# Altium schematic sheet Main.SchDoc
size A3; SheetNumber: 1; SheetTotal: 2
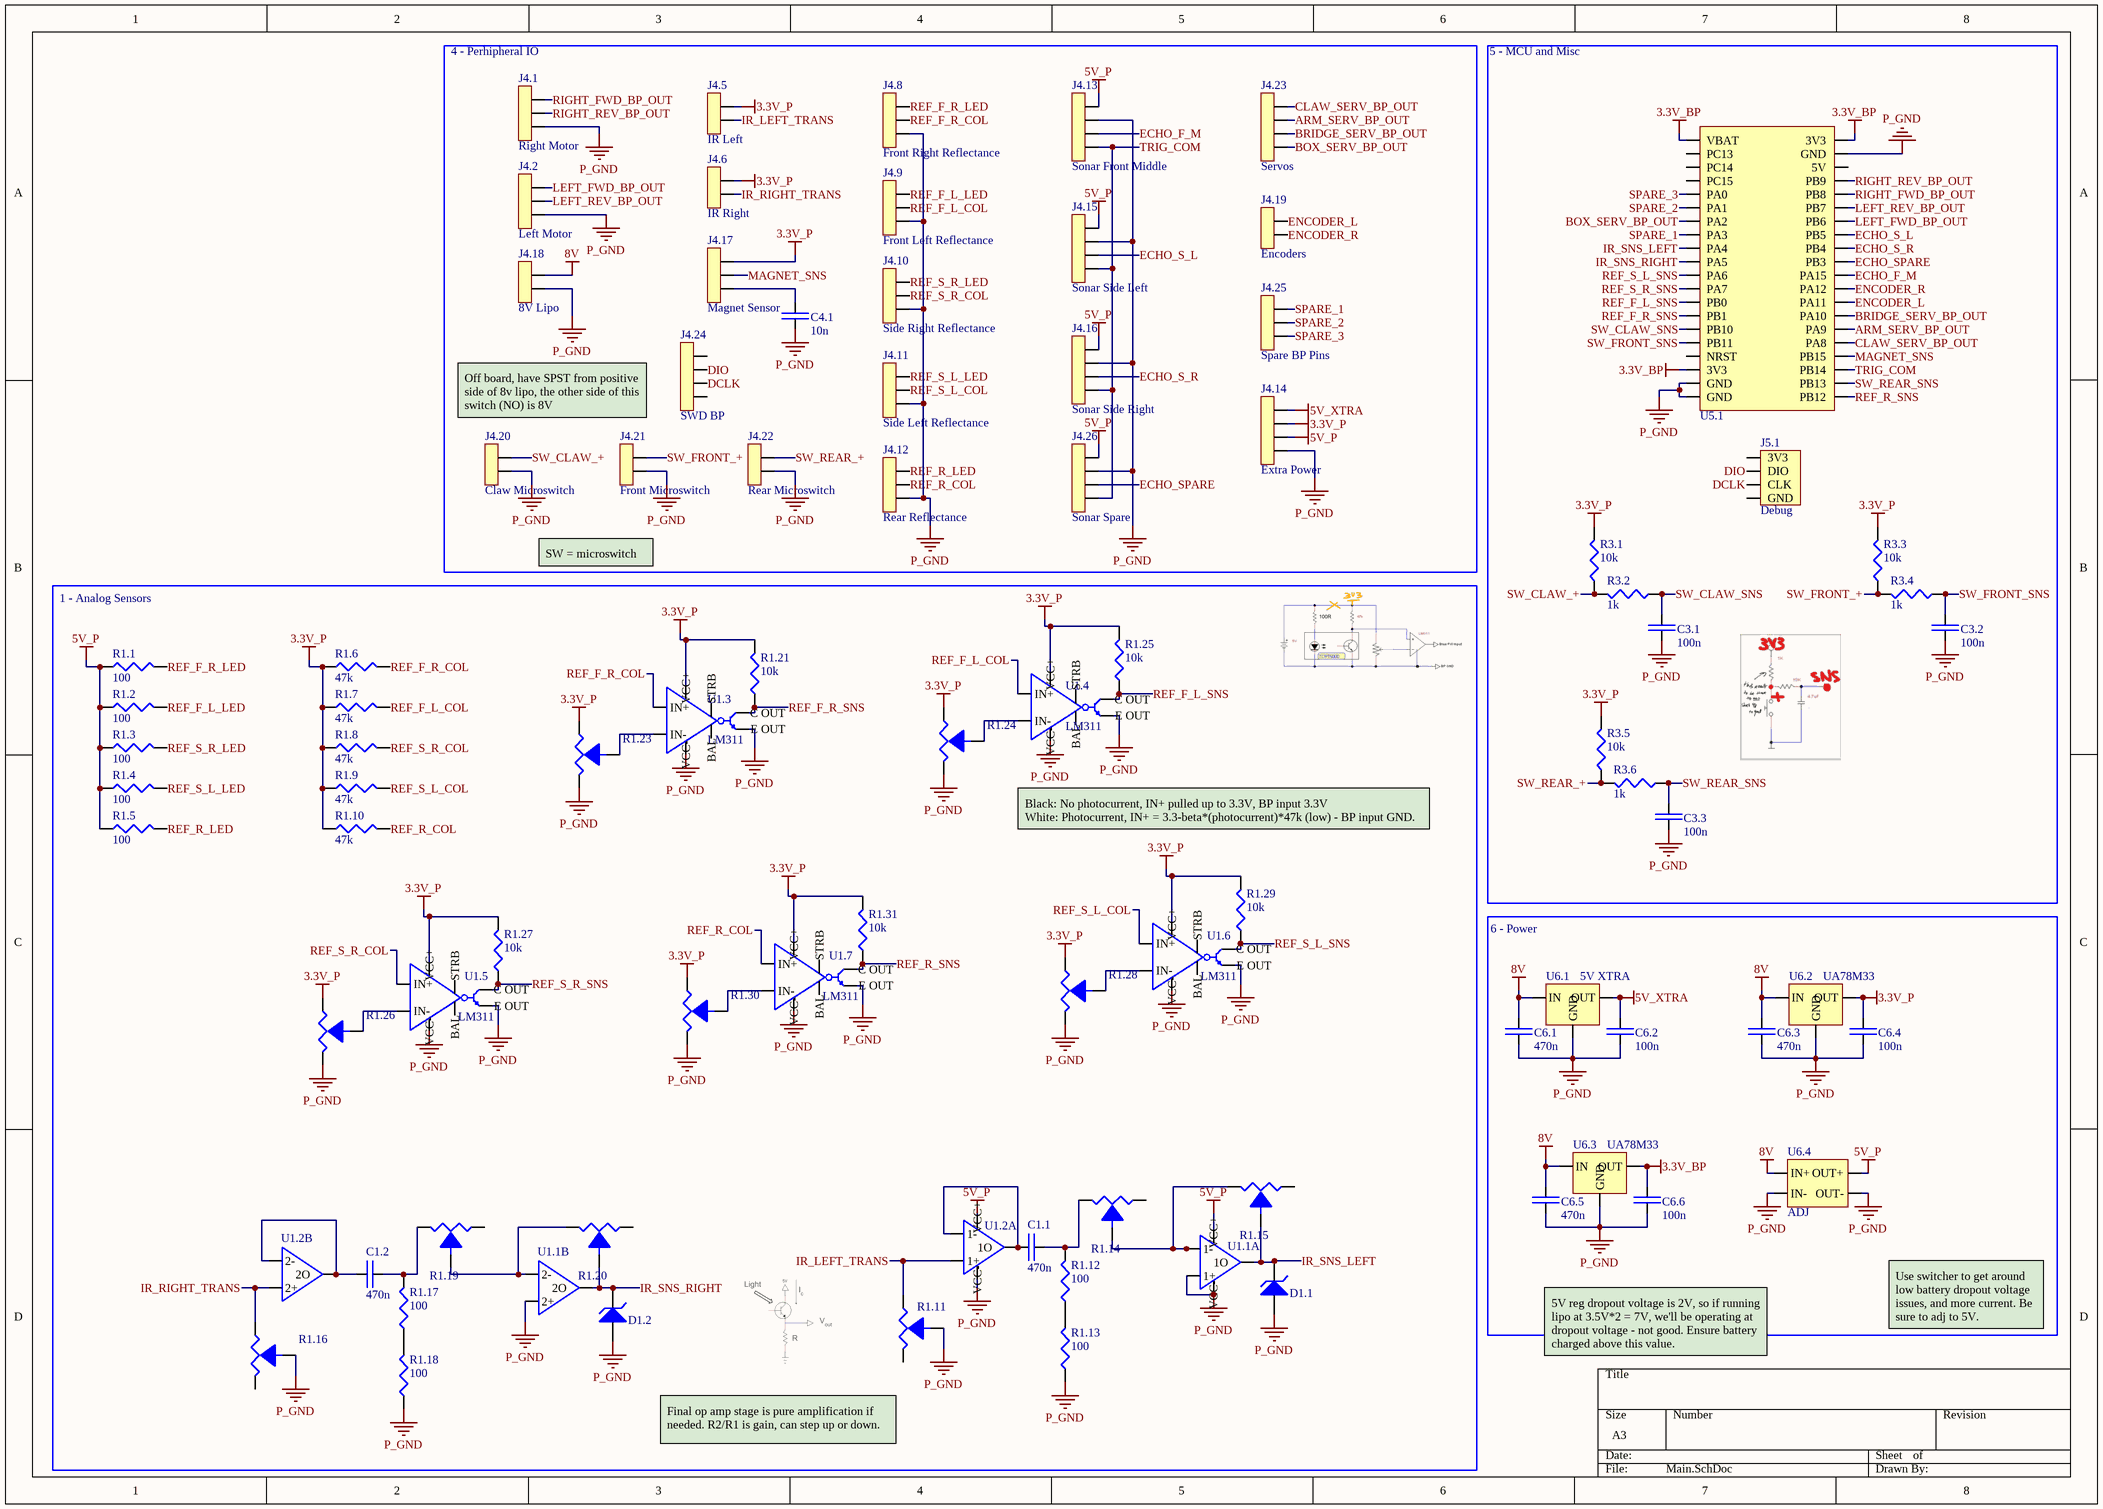
[diagram p0: Main.SchDoc]

## Parts
C1.1  470n  [Non Polarized Cap]
C1.2  470n  [Non Polarized Cap]
C3.1  100n  [Non Polarized Cap]
C3.2  100n  [Non Polarized Cap]
C3.3  100n  [Non Polarized Cap]
C4.1  10n  [Non Polarized Cap]
C6.1  470n  [Non Polarized Cap]
C6.2  100n  [Non Polarized Cap]
C6.3  470n  [Non Polarized Cap]
C6.4  100n  [Non Polarized Cap]
C6.5  470n  [Non Polarized Cap]
C6.6  100n  [Non Polarized Cap]
D1.1  3.3V  [Zener Generic]  (value not drawn)
D1.2  3.3V  [Zener Generic]  (value not drawn)
J4.1  Right Motor  [3pos JST]
J4.2  Left Motor  [3pos JST]
J4.5  IR Left  [2pos JST]
J4.6  IR Right  [2pos JST]
J4.8  Front Right Reflectance  [3pos JST]
J4.9  Front Left Reflectance  [3pos JST]
J4.10  Side Right Reflectance  [3pos JST]
J4.11  Side Left Reflectance  [3pos JST]
J4.12  Rear Reflectance  [3pos JST]
J4.13  Sonar Front Middle  [4Pos JST]
J4.14  Extra Power  [4Pos JST]
J4.15  Sonar Side Left  [4Pos JST]
J4.16  Sonar Side Right  [4Pos JST]
J4.17  Magnet Sensor  [3pos JST]
J4.18  8V Lipo  [2pos JST]
J4.19  Encoders  [2pos JST]
J4.20  Claw Microswitch  [2pos JST]
J4.21  Front Microswitch  [2pos JST]
J4.22  Rear Microswitch  [2pos JST]
J4.23  Servos  [4Pos JST]
J4.24  SWD BP  [4Pos JST]
J4.25  Spare BP Pins  [3pos JST]
J4.26  Sonar Spare  [4Pos JST]
J5.1  Debug  [Four Pads]
R1.1  100  [Res_Generic]
R1.2  100  [Res_Generic]
R1.3  100  [Res_Generic]
R1.4  100  [Res_Generic]
R1.5  100  [Res_Generic]
R1.6  47k  [Res_Generic]
R1.7  47k  [Res_Generic]
R1.8  47k  [Res_Generic]
R1.9  47k  [Res_Generic]
R1.10  47k  [Res_Generic]
R1.11  100k  [Pot Generic]  (value not drawn)
R1.12  100  [Res_Generic]
R1.13  100  [Res_Generic]
R1.14  10k  [Pot Generic]  (value not drawn)
R1.15  100k  [Pot Generic]  (value not drawn)
R1.16  100k  [Pot Generic]  (value not drawn)
R1.17  100  [Res_Generic]
R1.18  100  [Res_Generic]
R1.19  10k  [Pot Generic]  (value not drawn)
R1.20  100k  [Pot Generic]  (value not drawn)
R1.21  10k  [Res_Generic]
R1.23  10k  [Pot Generic]  (value not drawn)
R1.24  10k  [Pot Generic]  (value not drawn)
R1.25  10k  [Res_Generic]
R1.26  10k  [Pot Generic]  (value not drawn)
R1.27  10k  [Res_Generic]
R1.28  10k  [Pot Generic]  (value not drawn)
R1.29  10k  [Res_Generic]
R1.30  10k  [Pot Generic]  (value not drawn)
R1.31  10k  [Res_Generic]
R3.1  10k  [Res_Generic]
R3.2  1k  [Res_Generic]
R3.3  10k  [Res_Generic]
R3.4  1k  [Res_Generic]
R3.5  10k  [Res_Generic]
R3.6  1k  [Res_Generic]
U1.1  TL082IP  [DIP8]  (value not drawn)  (parts A,B of 2)
U1.2  TL082IP  [DIP8]  (value not drawn)  (parts A,B of 2)
U1.3  LM311  [DIP8]
U1.4  LM311  [DIP8]
U1.5  LM311  [DIP8]
U1.6  LM311  [DIP8]
U1.7  LM311  [DIP8]
U5.1  Bluepill  [DIP40]  (value not drawn)
U6.1  5V XTRA  [TO220]
U6.2  UA78M33  [TO220]
U6.3  UA78M33  [TO220]
U6.4  ADJ  [ADJ Switcher]

## Blocks framed on the sheet
4 - Perhipheral IO: C4.1 J4.1 J4.2 J4.5 J4.6 J4.8-J4.26
5 - MCU and Misc: C3.1-C3.3 J5.1 R3.1-R3.6 U5.1
1 - Analog Sensors: C1.1 C1.2 D1.1 D1.2 R1.1-R1.21 R1.23-R1.31 U1.1-U1.7
6 - Power: C6.1-C6.6 U6.1-U6.4

## Nets
3.3V_BP: C6.6.2 U5.1.1(VBAT) U5.1.18(3V3) U5.1.40(3V3) U6.3.3(OUT)
3.3V_P: C6.4.2 J4.5.2 J4.6.2 J4.14.3 J4.17.3 R1.6.1 R1.7.1 R1.8.1 R1.9.1 R1.10.1 R1.21.2 R1.23.3 R1.24.3 R1.25.2 R1.26.3 R1.27.2 R1.28.3 R1.29.2 R1.30.3 R1.31.2 R3.1.2 R3.3.2 R3.5.2 U1.3.8(VCC+) U1.4.8(VCC+) U1.5.8(VCC+) U1.6.8(VCC+) U1.7.8(VCC+) U6.2.3(OUT)
5V_P: J4.13.4 J4.14.2 J4.15.4 J4.16.4 J4.26.4 R1.1.1 R1.2.1 R1.3.1 R1.4.1 R1.5.1 U1.1.8(VCC+) U1.2.8(VCC+) U6.4.4(OUT+)
5V_XTRA: C6.2.2 J4.14.4 U6.1.3(OUT)
8V: C6.1.2 C6.3.2 C6.5.2 J4.18.2 U6.1.1(IN) U6.2.1(IN) U6.3.1(IN) U6.4.1(IN+)
P_GND: C3.1.1 C3.2.1 C3.3.1 C4.1.1 C6.1.1 C6.2.1 C6.3.1 C6.4.1 C6.5.1 C6.6.1 D1.1.1(Anode) D1.2.1(Anode) J4.1.1 J4.2.1 J4.8.1 J4.9.1 J4.10.1 J4.11.1 J4.12.1 J4.13.3 J4.14.1 J4.15.3 J4.16.3 J4.18.1 J4.20.1 J4.21.1 J4.22.1 J4.26.3 R1.11.2 R1.13.1 R1.16.2 R1.18.1 R1.23.1 R1.24.1 R1.26.1 R1.28.1 R1.30.1 U1.1.3(1+) U1.1.4(VCC-) U1.1.5(2+) U1.2.4(VCC-) U1.3.1(E_OUT) U1.3.4(VCC-) U1.4.1(E_OUT) U1.4.4(VCC-) U1.5.1(E_OUT) U1.5.4(VCC-) U1.6.1(E_OUT) U1.6.4(VCC-) U1.7.1(E_OUT) U1.7.4(VCC-) U5.1.19(GND) U5.1.20(GND) U5.1.39(GND) U6.1.2(GND) U6.2.2(GND) U6.3.2(GND) U6.4.2(IN-) U6.4.3(OUT-)
ARM_SERV_BP_OUT: J4.23.3 U5.1.26(PA9)
BOX_SERV_BP_OUT: J4.23.1 U5.1.7(PA2)
BRIDGE_SERV_BP_OUT: J4.23.2 U5.1.27(PA10)
CLAW_SERV_BP_OUT: J4.23.4 U5.1.25(PA8)
DCLK: J4.24.2 J5.1.3(CLK)
DIO: J4.24.3 J5.1.2(DIO)
ECHO_F_M: J4.13.2 U5.1.30(PA15)
ECHO_S_L: J4.15.2 U5.1.33(PB5)
ECHO_S_R: J4.16.2 U5.1.32(PB4)
ECHO_SPARE: J4.26.2 U5.1.31(PB3)
ENCODER_L: J4.19.2 U5.1.28(PA11)
ENCODER_R: J4.19.1 U5.1.29(PA12)
IR_LEFT_TRANS: J4.5.1 R1.11.3 U1.2.3(1+)
IR_RIGHT_TRANS: J4.6.1 R1.16.3 U1.2.5(2+)
IR_SNS_LEFT: D1.1.2(Cathode) R1.15.2 U1.1.1(1O) U5.1.9(PA4)
IR_SNS_RIGHT: D1.2.2(Cathode) R1.20.2 U1.1.7(2O) U5.1.10(PA5)
LEFT_FWD_BP_OUT: J4.2.3 U5.1.34(PB6)
LEFT_REV_BP_OUT: J4.2.2 U5.1.35(PB7)
MAGNET_SNS: J4.17.2 U5.1.24(PB15)
REF_F_L_COL: J4.9.2 R1.7.2 U1.4.2(IN+)
REF_F_L_LED: J4.9.3 R1.2.2
REF_F_L_SNS: R1.25.1 U1.4.7(C_OUT) U5.1.13(PB0)
REF_F_R_COL: J4.8.2 R1.6.2 U1.3.2(IN+)
REF_F_R_LED: J4.8.3 R1.1.2
REF_F_R_SNS: R1.21.1 U1.3.7(C_OUT) U5.1.14(PB1)
REF_R_COL: J4.12.2 R1.10.2 U1.7.2(IN+)
REF_R_LED: J4.12.3 R1.5.2
REF_R_SNS: R1.31.1 U1.7.7(C_OUT) U5.1.21(PB12)
REF_S_L_COL: J4.11.2 R1.9.2 U1.6.2(IN+)
REF_S_L_LED: J4.11.3 R1.4.2
REF_S_L_SNS: R1.29.1 U1.6.7(C_OUT) U5.1.11(PA6)
REF_S_R_COL: J4.10.2 R1.8.2 U1.5.2(IN+)
REF_S_R_LED: J4.10.3 R1.3.2
REF_S_R_SNS: R1.27.1 U1.5.7(C_OUT) U5.1.12(PA7)
RIGHT_FWD_BP_OUT: J4.1.3 U5.1.36(PB8)
RIGHT_REV_BP_OUT: J4.1.2 U5.1.37(PB9)
SPARE_1: J4.25.3 U5.1.8(PA3)
SPARE_2: J4.25.2 U5.1.6(PA1)
SPARE_3: J4.25.1 U5.1.5(PA0)
SW_CLAW_+: J4.20.2 R3.1.1 R3.2.2
SW_CLAW_SNS: C3.1.2 R3.2.1 U5.1.15(PB10)
SW_FRONT_+: J4.21.2 R3.3.1 R3.4.2
SW_FRONT_SNS: C3.2.2 R3.4.1 U5.1.16(PB11)
SW_REAR_+: J4.22.2 R3.5.1 R3.6.2
SW_REAR_SNS: C3.3.2 R3.6.1 U5.1.22(PB13)
TRIG_COM: J4.13.1 J4.15.1 J4.16.1 J4.26.1 U5.1.23(PB14)
NetC1.1_1: C1.1.1 U1.2.1(1O) U1.2.2(1-)
NetC1.1_2: C1.1.2 R1.12.2 R1.14.1
NetC1.2_1: C1.2.1 U1.2.6(2-) U1.2.7(2O)
NetC1.2_2: C1.2.2 R1.17.2 R1.19.1
NetC4.1_2: C4.1.2 J4.17.1
NetR1.12_1: R1.12.1 R1.13.2
NetR1.14_2: R1.14.2 R1.15.1 U1.1.2(1-)
NetR1.17_1: R1.17.1 R1.18.2
NetR1.19_2: R1.19.2 R1.20.1 U1.1.6(2-)
NetR1.23_2: R1.23.2 U1.3.3(IN-)
NetR1.24_2: R1.24.2 U1.4.3(IN-)
NetR1.26_2: R1.26.2 U1.5.3(IN-)
NetR1.28_2: R1.28.2 U1.6.3(IN-)
NetR1.30_2: R1.30.2 U1.7.3(IN-)

Not connected (* = marked no-connect by the designer): J4.24 1 4; J5.1 1(3V3) 4(GND); R1.11 1; R1.14 3; R1.15 3; R1.16 1; R1.19 3; R1.20 3; U1.3 5(BAL) 6(STRB); U1.4 5(BAL) 6(STRB); U1.5 5(BAL) 6(STRB); U1.6 5(BAL) 6(STRB); U1.7 5(BAL) 6(STRB); U5.1 2(PC13) 3(PC14) 4(PC15) 17(NRST) 38(5V)

## Notes on the sheet
- Off board, have SPST from positive side of 8v lipo, the other side of this switch (NO) is 8V
- SW = microswitch
- Black: No photocurrent, IN+ pulled up to 3.3V, BP input 3.3V
  White: Photocurrent, IN+ = 3.3-beta*(photocurrent)*47k (low) - BP input GND.
- Use switcher to get around low battery dropout voltage issues, and more current. Be sure to adj to 5V.
- 5V reg dropout voltage is 2V, so if running lipo at 3.5V*2 = 7V, we'll be operating at dropout voltage - not good. Ensure battery charged above this value.
- (near R1.11) Final op amp stage is pure amplification if needed. R2/R1 is gain, can step up or down.

## Library data of the parts
C1.1 C1.2 C3.1-C3.3 C4.1 C6.1-C6.6 = Cap_Generic
D1.1 D1.2 = Zener_Generic
J4.1 J4.2 J4.8-J4.12 J4.17 J4.25 = 3pos Conn
J4.5 J4.6 J4.18-J4.22 = 2pos Conn: 2pos Conn JST
J4.13-J4.16 J4.23 J4.24 J4.26 = 4pos Conn
J5.1 = BP SWD Conn
R1.1-R1.10 R1.12 R1.13 R1.17 R1.18 R1.21 R1.25 R1.27 R1.29 R1.31 R3.1-R3.6 = Res_Generic
R1.11 R1.14-R1.16 R1.19 R1.20 R1.23 R1.24 R1.26 R1.28 R1.30 = Pot_Generic
U1.1 U1.2 = TL082IP Op Amp: TL082IP IC OPAMP JFET 2 CIRCUIT 8DIP; Supplier 1: Mouser; Supplier Part Number 1: 595-TL082IP
U1.3-U1.7 = LM311 Comparator: LM311 IC DIFF COMPARATOR STROBE 8-DIP; Supplier 1: Mouser; Supplier Part Number 1: 595-LM311P
U5.1 = Bluepill: STM32F103C8T6
U6.1 = UA7805 5V Reg: UA7805 IC REG LINEAR 5V 1.5A TO220-3; Supplier 1: Digi-Key; Supplier Part Number 1: 296-39515-5-ND
U6.2 U6.3 = UA78M33CKCS 3.3V Reg: UA78M33 IC REG LINEAR 3.3V 500MA TO220-3; Supplier 1: Mouser; Supplier Part Number 1: 595-UA78M33CKCS
U6.4 = LM2596S: Adjutable Switcher 3.5A Max